# EAGLE design RcrSchemBack (EAGLE 8.4.0)
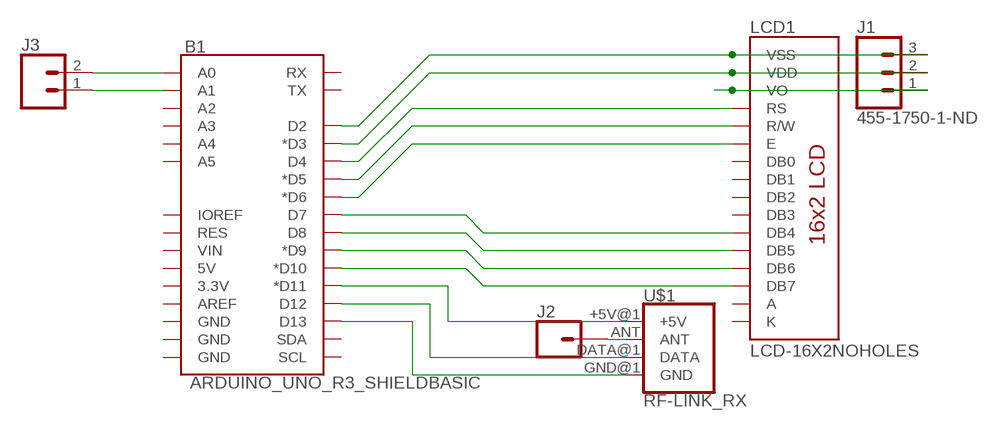
[diagram p0: schematic, sheet 1]

## Parts
B1  ARDUINO_UNO_R3_SHIELDBASIC  [UNO_R3_SHIELD]
J1  455-1750-1-ND  CONN_03  [1X03]
J2  CONN_01  [1X01]
J3  CONN_02  [1X02]
LCD1  LCD-16X2NOHOLES  [LCD-16X2_NOHOLESNOSILK]
U$1  RF-LINK_RX  [RF-LINK_RX]

## Nets
N$1: B1.D2 J1.3 LCD1.1(VSS)
N$2: B1.D3(*D3) J1.2 LCD1.2(VDD)
N$3: B1.D4 LCD1.4(RS)
N$4: B1.D5(*D5) LCD1.5(R/W)
N$5: B1.D6(*D6) LCD1.6(E)
N$6: B1.D7 LCD1.11(DB4)
N$7: B1.D8 LCD1.12(DB5)
N$8: B1.D9(*D9) LCD1.13(DB6)
N$9: B1.D10(*D10) LCD1.14(DB7)
N$10: J2.1 U$1.ANT
N$11: B1.D11(*D11) U$1.+5V@1(+5V)
N$12: B1.D12 U$1.DATA@1(DATA)
N$13: B1.D13 U$1.GND@1(GND)
N$14: J1.1 LCD1.3(VO)
N$15: B1.A0 J3.2
N$16: B1.A1 J3.1
Unconnected: B1.3.3V B1.5V B1.A2 B1.A3 B1.A4 B1.A5 B1.AREF B1.GND@0(GND) B1.GND@1(GND) B1.GND@2(GND) B1.IOREF B1.RES B1.RX B1.SCL B1.SDA B1.TX B1.VIN LCD1.7(DB0) LCD1.8(DB1) LCD1.9(DB2) LCD1.10(DB3)

## Power pins joined to a net without a drawn wire
A: LCD1.15(A)
K: LCD1.16(K)

## Library data of the parts
B1 = SparkFun-Boards:ARDUINO_UNO_R3_SHIELD: Arduino R3 Shield Footprint Shield form compatible with the Arduino Uno R3. SparkFun Products: MG2639 Cellular Shield <https://www.sparkfun.com/products/13120> MIDI Shield <https://www.sparkfun.com/products/12898> R3 Stackable Headers Kit <https://www.sparkfun.com/products/11417>
J1 = SparkFun-Connectors:CONN_03: Multi connection point. Often used as Generic Header-pin footprint for 0.1 inch spaced/style header connections On any of the 0.1 inch spaced packages, you can populate with these: Break Away Headers - Straight <https://www.sparkfun.com/products/116> (PRT-00116) Break Away Male Headers - Right Angle <https://www.sparkfun.com/products/553> (PRT-00553) Female Headers <https://www.sparkfun.com/products/115> (PRT-00115) Break Away Headers - Machine Pin <https://www.sparkfun.com/products/117> (PRT-00117) Break Away Female Headers - Swiss Machine Pin <https://www.sparkfun.com/products/743> (PRT-00743) Stackable Header - 3 Pin (Female, 0.1") <https://www.sparkfun.com/products/13875> (PRT-13875) For SCREWTERMINALS and SPRING TERMINALS visit here: Screw Terimnals on SparkFun.com <https://www.sparkfun.com/search/results?term=Screw+Terminals> (5mm/3.5mm/2.54mm spacing) This device is also useful as a general connection point to wire up your design to another part of your project. Our various solder wires solder well into these plated through hole pads. Hook-Up Wire - Assortment (Stranded, 22 AWG) <https://www.sparkfun.com/products/11375> (PRT-11375) Hook-Up Wire - Assortment (Solid Core, 22 AWG) <https://www.sparkfun.com/products/11367> (PRT-11367) View the entire wire category on our website here <https://www.sparkfun.com/categories/141> Special notes: Molex polarized connector foot print use with SKU : PRT-08232 with associated crimp pins and housings.; PROD_ID: XXX-00000
J2 = SparkFun-Connectors:CONN_01: Single connection point. Often used as Generic Header-pin footprint for 0.1 inch spaced/style header connections On any of the 0.1 inch spaced packages, you can populate with these: Break Away Headers - Straight <https://www.sparkfun.com/products/116> (PRT-00116) Break Away Male Headers - Right Angle <https://www.sparkfun.com/products/553> (PRT-00553) Female Headers <https://www.sparkfun.com/products/115> (PRT-00115) Break Away Headers - Machine Pin <https://www.sparkfun.com/products/117> (PRT-00117) Break Away Female Headers - Swiss Machine Pin <https://www.sparkfun.com/products/743> (PRT-00743) This device is also useful as a general connection point to wire up your design to another part of your project. Our various solder wires solder well into these plated through hole pads. Hook-Up Wire - Assortment (Stranded, 22 AWG) <https://www.sparkfun.com/products/11375> (PRT-11375) Hook-Up Wire - Assortment (Solid Core, 22 AWG) <https://www.sparkfun.com/products/11367> (PRT-11367) View the entire wire category on our website here <https://www.sparkfun.com/categories/141> Special notes: SMTSO-256-ET is a "flush mount" nut for a 4-40 screw. We mostly use this on specialty testbeds; it is a nice way to connect hardware to your PCB at an adjustable hieght. Also note, the SNAP packages are for using a snappable style connector. We sell a baggie of snaps and they are also used on two LilyPad designs: Snap Assortment - 30 pack (male and female) <https://www.sparkfun.com/products/11347> (DEV-11347) LilyPad Arduino SimpleSnap <https://www.sparkfun.com/products/10941> (DEV-10941) LilyPad SimpleSnap Protoboard <https://www.sparkfun.com/products/10940> (DEV-10940)
J3 = SparkFun-Connectors:CONN_02: Multi connection point. Often used as Generic Header-pin footprint for 0.1 inch spaced/style header connections On any of the 0.1 inch spaced packages, you can populate with these: Break Away Headers - Straight <https://www.sparkfun.com/products/116> (PRT-00116) Break Away Male Headers - Right Angle <https://www.sparkfun.com/products/553> (PRT-00553) Female Headers <https://www.sparkfun.com/products/115> (PRT-00115) Break Away Headers - Machine Pin <https://www.sparkfun.com/products/117> (PRT-00117) Break Away Female Headers - Swiss Machine Pin <https://www.sparkfun.com/products/743> (PRT-00743) For SCREWTERMINALS and SPRING TERMINALS visit here: Screw Terimnals on SparkFun.com <https://www.sparkfun.com/search/results?term=Screw+Terminals> (5mm/3.5mm/2.54mm spacing) This device is also useful as a general connection point to wire up your design to another part of your project. Our various solder wires solder well into these plated through hole pads. Hook-Up Wire - Assortment (Stranded, 22 AWG) <https://www.sparkfun.com/products/11375> (PRT-11375) Hook-Up Wire - Assortment (Solid Core, 22 AWG) <https://www.sparkfun.com/products/11367> (PRT-11367) View the entire wire category on our website here <https://www.sparkfun.com/categories/141> Special notes: Molex polarized connector foot print use with: PRT-08233 with associated crimp pins and housings. 2.54_SCREWTERM for use with PRT-10571. 3.5mm Screw Terminal footprints for PRT-08084 5mm Screw Terminal footprints for use with PRT-08432
LCD1 = SparkFun-Displays:LCD-16X2: Standard text-only 16x2 parallel input LCD Basic 16 character by 2 line display. Typically utilizes the extremely common HD44780 parallel interface chipset SparkFun Products: Basic 16x2 Green <https://www.sparkfun.com/products/255> Basic 8x2 Green <https://www.sparkfun.com/products/11122>; SF_ID: LCD-00255
U$1 = SparkFun-RF:RF-LINK_RX: RF Link Receiver (434 MHz, 315 MHz) These wireless receivers work with equivalent transmitters. They can easily fit into a breadboard and work well with microcontrollers to create a very simple wireless data link. Since these are only receivers, they will only work communicating data one-way, you would need two pairs (of different frequencies) to act as a transmitter/receiver pair.. SparkFun Products RF Link Receiver - 4800bps (434 MHz) <https://www.sparkfun.com/products/10532>(WRL-10532); SF_ID: WRL-10533

## Board
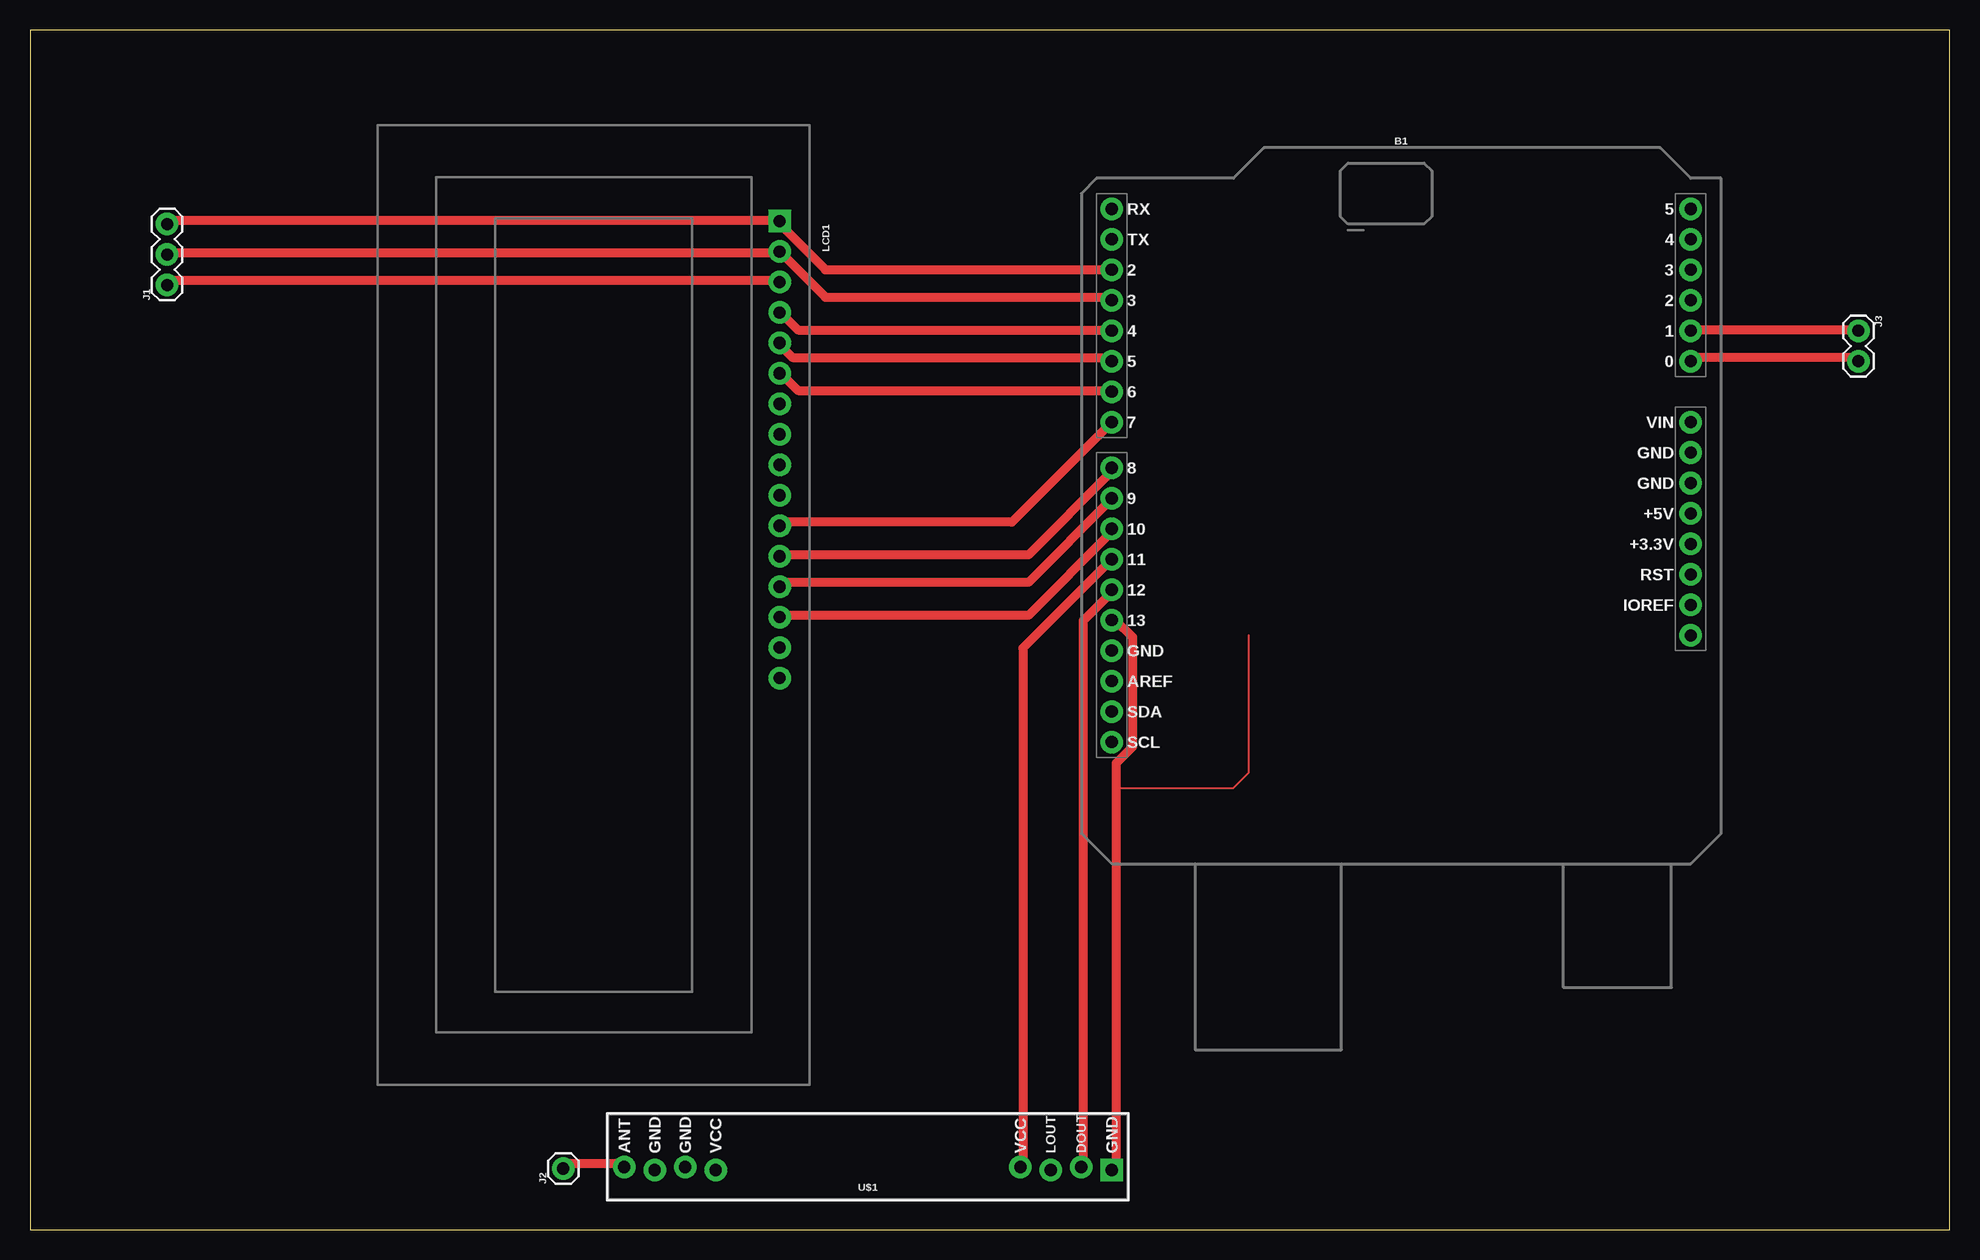
[diagram p1: board, top side]

Size 160 x 100 mm. Coordinates in mm from the lower left corner, seen from the top.
Outline: 0,0 160,0 160,100 0,100 0,0
Copper layers (1*16): Top 0.035mm / dielectric 1.5mm / Bottom 0.035mm
Design rules "default *": minimum track width 30mil, minimum drill 6mm, track to track 6mil, track to pad 6mil, pad to pad 6mil, via to via 6mil, smd to smd 6mil, copper to edge 40mil, drill to drill 6mil, minimum pad ring 10mil, minimum via ring 8mil, stop-mask expansion 4mil, vias tented up to drill 0mil, thermal gap 10mil

### Footprints (pad centres in the part's own frame; a part is rotated, then mirrored left to right if it is on the bottom)
UNO_R3_SHIELD = drill 1.016 pad 1.88: 3.3V 24.13,-2.54; 5V 24.13,0; A0 24.13,12.7; A1 24.13,15.24; A2 24.13,17.78; A3 24.13,20.32; A4 24.13,22.86; A5 24.13,25.4; AREF -24.13,-13.97; D2 -24.13,20.32; D3 -24.13,17.78; D4 -24.13,15.24; D5 -24.13,12.7; D6 -24.13,10.16; D7 -24.13,7.62; D8 -24.13,3.81; D9 -24.13,1.27; D10 -24.13,-1.27; D11 -24.13,-3.81; D12 -24.13,-6.35; D13 -24.13,-8.89; GND@0 24.13,2.54; GND@1 24.13,5.08; GND@2 -24.13,-11.43; IOREF 24.13,-7.62; NC 24.13,-10.16; RES 24.13,-5.08; RX -24.13,25.4; SCL -24.13,-19.05; SDA -24.13,-16.51; TX -24.13,22.86; VIN 24.13,7.62
1X03 = drill 1.016 pad 1.88: 1 0,0; 2 2.54,0; 3 5.08,0
1X01 = drill 1.016 pad 1.88: 1 0,0
1X02 = drill 1.016 pad 1.88: 1 0,0; 2 2.54,0
LCD-16X2_NOHOLESNOSILK = drill 1.016 pad 1.88 square: 1 -32,15.5 | drill 1.016 pad 1.88: 2 -29.46,15.5; 3 -26.92,15.5; 4 -24.38,15.5; 5 -21.84,15.5; 6 -19.3,15.5; 7 -16.76,15.5; 8 -14.22,15.5; 9 -11.68,15.5; 10 -9.14,15.5; 11 -6.6,15.5; 12 -4.06,15.5; 13 -1.52,15.5; 14 1.02,15.5; 15 3.56,15.5; 16 6.1,15.5
RF-LINK_RX = drill 1.016 pad 1.88: +5V@1 -12.7,-0.127; +5V@2 12.7,0.127; ANT 20.32,-0.127; DATA@1 -17.78,-0.127; DATA@2 -15.24,0.127; GND@2 15.24,-0.127; GND@3 17.78,0.127 | drill 1.016 pad 1.88 square: GND@1 -20.32,0.127

### Placement (x,y rotation side)
B1  114.3,59.69 0 top
J1  11.43,78.74 90 top
J2  44.45,5.08 90 top
J3  152.4,74.93 270 top
LCD1  46.99,52.07 270 top
U$1  69.85,5.08 180 top

### Tracks (layer width: path | path; a pad name or v marks a point on that pad's centre or on a via)
N$1
  Top 0.762: J1.3 11.43,84.12 62.18,84.12 LCD1.1 62.64,83.67 66.29,80.01 B1.D2
N$2
  Top 0.762: J1.2 11.43,81.38 62.18,81.38 LCD1.2 62.64,81.38 66.29,77.72 90.07,77.72 B1.D3
N$3
  Top 0.762: B1.D4 90.07,74.98 64.01,74.98 62.64,76.35 LCD1.4
N$4
  Top 0.762: B1.D5 90.07,72.69 63.55,72.69 62.64,73.61 LCD1.5
N$5
  Top 0.762: B1.D6 90.07,69.95 64.01,69.95 62.64,71.32 LCD1.6
N$6
  Top 0.762: B1.D7 81.84,58.98 62.64,58.98 LCD1.11
N$7
  Top 0.762: LCD1.12 62.64,56.24 83.21,56.24 90.07,63.09 B1.D8
N$8
  Top 0.762: LCD1.13 62.64,53.95 83.21,53.95 90.07,60.81 B1.D9
N$9
  Top 0.762: LCD1.14 62.64,51.21 83.21,51.21 90.07,58.06 B1.D10
N$10
  Top 0.762: J2.1 44.81,5.49 49.38,5.49 U$1.ANT
N$11
  Top 0.762: B1.D11 82.75,48.46 82.75,5.49 U$1.+5V@1
N$12
  Top 0.762: U$1.DATA@1 87.78,5.49 87.78,50.75 90.07,53.03 B1.D12
N$13
  Top 0.152: 90.53,36.83 100.33,36.83 101.6,38.1 101.6,49.53
  Top 0.762: U$1.GND@1 90.53,5.03 90.53,38.86 91.9,40.23 91.9,49.38 90.53,50.75 B1.D13
N$14
  Top 0.762: J1.1 11.43,79.1 62.18,79.1 LCD1.3
N$15
  Top 0.762: B1.A0 138.53,72.69 152.25,72.69 J3.2
N$16
  Top 0.762: B1.A1 138.53,74.98 152.25,74.98 J3.1